# Altium project Adapter_Board.PrjPcb
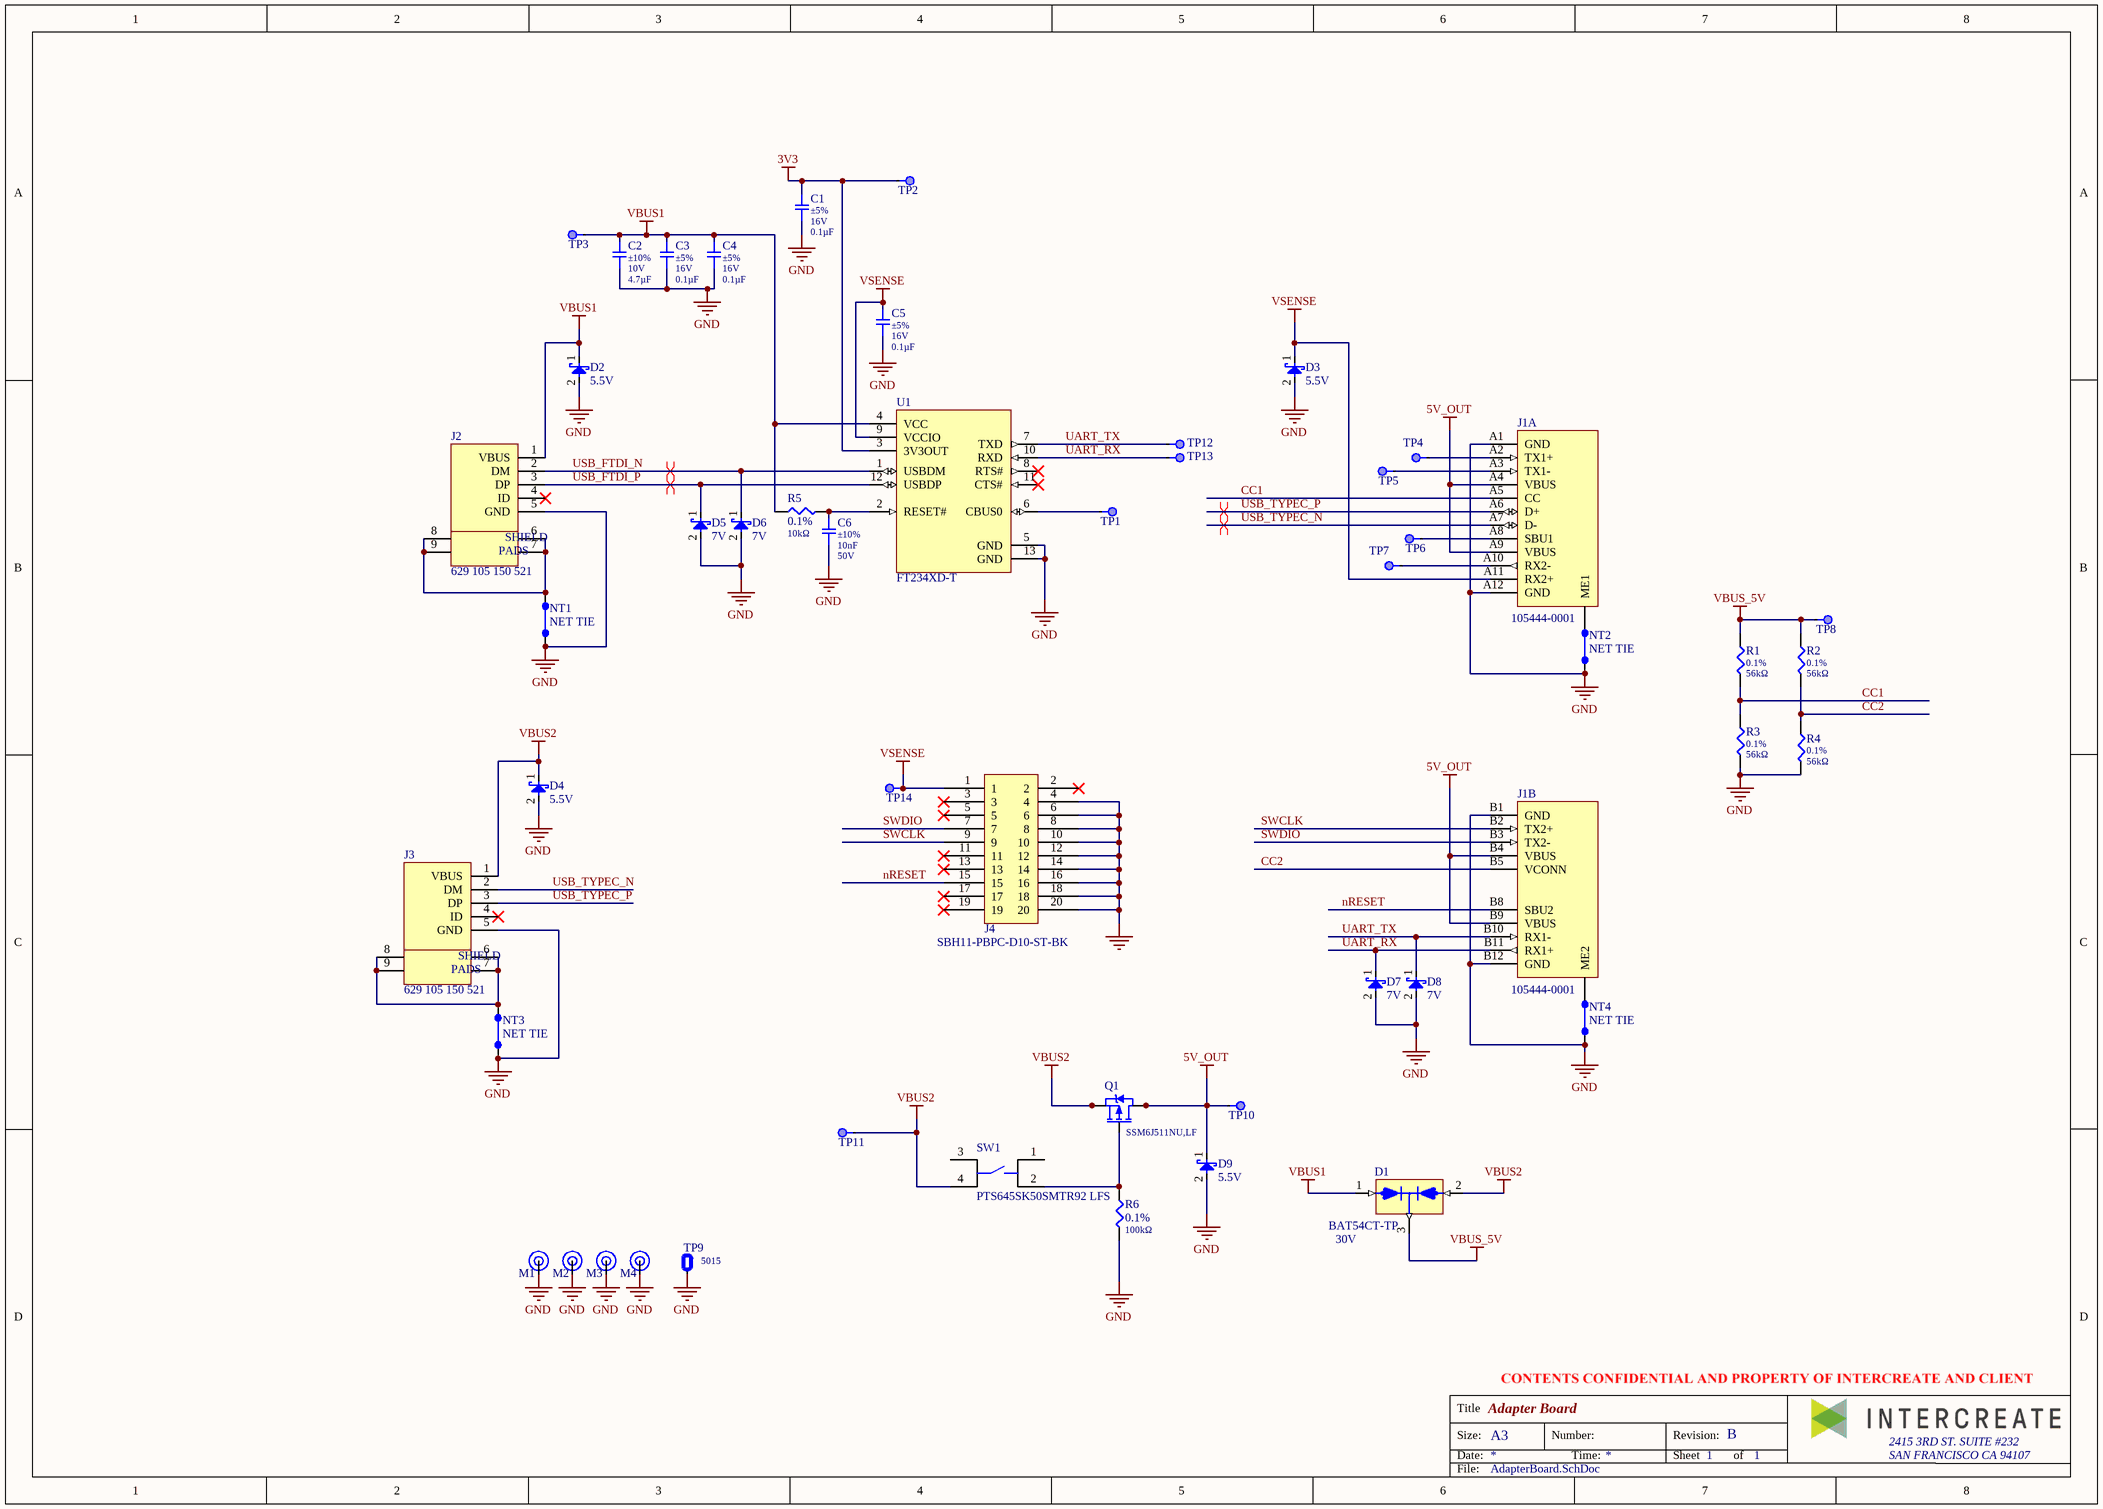
[diagram p0: AdapterBoard.SchDoc]
1 sheet, 50 parts. Net scope: global (net labels, ports and power ports of the same name join across sheets).
Board file: AdapterBoard.PcbDoc

## Sheet AdapterBoard.SchDoc: Adapter Board
size A3; Organization: INTERCREATE; Address1: 2415 3RD ST. SUITE #232; Address2: SAN FRANCISCO CA 94107; Revision: B; SheetNumber: 1; SheetTotal: 1; ProjectName: KAGWERKS COMMAND CENTER

### Parts
C1  value 0.1µF  Tolerance: ±5%  Voltage Rating: 16V  [CAP-0402]  (hidden comment: GRM155R71C104JA88D)
C2  value 4.7µF  Tolerance: ±10%  Voltage Rating: 10V  [CAP-0402]  (hidden comment: CL05A475KP5NRNC)
C3  value 0.1µF  Tolerance: ±5%  Voltage Rating: 16V  [CAP-0402]  (hidden comment: GRM155R71C104JA88D)
C4  value 0.1µF  Tolerance: ±5%  Voltage Rating: 16V  [CAP-0402]  (hidden comment: GRM155R71C104JA88D)
C5  value 0.1µF  Tolerance: ±5%  Voltage Rating: 16V  [CAP-0402]  (hidden comment: GRM155R71C104JA88D)
C6  value 10nF  Tolerance: ±10%  Voltage Rating: 50V  [CAP-0402]  (hidden comment: GCM155R71H103KA55D)
D1  BAT54CT-TP  Voltage Rating (DC): 30V  [IC-SOT-523]
D2  Reverse Standoff Voltage: 5.5V  [DIODE-CST2C]  (hidden comment: DF2S6P2CTC,L3F)
D3  Reverse Standoff Voltage: 5.5V  [DIODE-CST2C]  (hidden comment: DF2S6P2CTC,L3F)
D4  Reverse Standoff Voltage: 5.5V  [DIODE-CST2C]  (hidden comment: DF2S6P2CTC,L3F)
D5  Reverse Standoff Voltage: 7V  [DIODE-0402-LITTLEFUSE]  (hidden comment: RF2943-000)
D6  Reverse Standoff Voltage: 7V  [DIODE-0402-LITTLEFUSE]  (hidden comment: RF2943-000)
D7  Reverse Standoff Voltage: 7V  [DIODE-0402-LITTLEFUSE]  (hidden comment: RF2943-000)
D8  Reverse Standoff Voltage: 7V  [DIODE-0402-LITTLEFUSE]  (hidden comment: RF2943-000)
D9  Reverse Standoff Voltage: 5.5V  [DIODE-CST2C]  (hidden comment: DF2S6P2CTC,L3F)
J1  105444-0001  [CONN-M-USB-C]  (parts A,B of 2)
J2  629 105 150 521  [CONN-R-USB-UB-629105150521]
J3  629 105 150 521  [CONN-R-USB-UB-629105150521]
J4  SBH11-PBPC-D10-ST-BK  [HDR-V-2x10-KEYED]
M1  N/A  [HOLE-M2-NO-SILK]  (value not drawn)  (no BOM)
M2  N/A  [HOLE-M2-NO-SILK]  (value not drawn)  (no BOM)
M3  N/A  [HOLE-M2-NO-SILK]  (value not drawn)  (no BOM)
M4  N/A  [HOLE-M2-NO-SILK]  (value not drawn)  (no BOM)
NT1  NET TIE  [NET_TIE]  (net tie, no BOM)
NT2  NET TIE  [NET_TIE]  (net tie, no BOM)
NT3  NET TIE  [NET_TIE]  (net tie, no BOM)
NT4  NET TIE  [NET_TIE]  (net tie, no BOM)
Q1  SSM6J511NU,LF  [FET-6-DFN-EP]
R1  value 56kΩ  Tolerance: 0.1%  [RES-0402]  (hidden comment: RT0402BRD0756KL)
R2  value 56kΩ  Tolerance: 0.1%  [RES-0402]  (hidden comment: RT0402BRD0756KL)
R3  value 56kΩ  Tolerance: 0.1%  [RES-0402]  (hidden comment: RT0402BRD0756KL)
R4  value 56kΩ  Tolerance: 0.1%  [RES-0402]  (hidden comment: RT0402BRD0756KL)
R5  value 10kΩ  Tolerance: 0.1%  [RES-0402]  (hidden comment: RT0402BRE0710KL)
R6  value 100kΩ  Tolerance: 0.1%  [RES-0402]  (hidden comment: RT0402BRD07100KL)
SW1  PTS645SK50SMTR92 LFS  [BTN-SPST-PTS645SK50SMTR92]
TP1  N/A  [TP-0.75MM]  (value not drawn)  (no BOM)
TP2  N/A  [TP-0.75MM]  (value not drawn)  (no BOM)
TP3  N/A  [TP-0.75MM]  (value not drawn)  (no BOM)
TP4  N/A  [TP-0.75MM]  (value not drawn)  (no BOM)
TP5  N/A  [TP-0.75MM]  (value not drawn)  (no BOM)
TP6  N/A  [TP-0.75MM]  (value not drawn)  (no BOM)
TP7  N/A  [TP-0.75MM]  (value not drawn)  (no BOM)
TP8  N/A  [TP-0.75MM]  (value not drawn)  (no BOM)
TP9  5015  [TP-5015]
TP10  N/A  [TP-0.75MM]  (value not drawn)  (no BOM)
TP11  N/A  [TP-0.75MM]  (value not drawn)  (no BOM)
TP12  N/A  [TP-0.75MM]  (value not drawn)  (no BOM)
TP13  N/A  [TP-0.75MM]  (value not drawn)  (no BOM)
TP14  N/A  [TP-0.75MM]  (value not drawn)  (no BOM)
U1  FT234XD-T  [IC-DFN-12P]

### Nets
3V3: C1.2 TP2.1(TP_1P0MM) U1.3(3V3OUT)
5V_OUT: D9.1(K) J1.A4(VBUS) J1.A9(VBUS) J1.B4(VBUS) J1.B9(VBUS) Q1.1(D) Q1.2(D) Q1.5(D) Q1.6(D) Q1.8(D) TP10.1(TP_1P0MM)
GND: C1.1 C2.1 C3.1 C4.1 C5.1 C6.1 D2.2(A) D3.2(A) D4.2(A) D5.2(A) D6.2(A) D7.2(A) D8.2(A) D9.2(A) J1.A1(GND) J1.A12(GND) J1.B1(GND) J1.B12(GND) J2.5(GND) J3.5(GND) J4.4 J4.6 J4.8 J4.10 J4.12 J4.14 J4.16 J4.18 J4.20 M1.1 M2.1 M3.1 M4.1 NT1.1 NT2.1 NT3.1 NT4.1 R3.2 R4.2 R6.2 TP9.1 U1.5(GND) U1.13(GND)
VBUS1: C2.2 C3.2 C4.2 D1.1 D2.1(K) J2.1(VBUS) R5.1 TP3.1(TP_1P0MM) U1.4(VCC)
VBUS2: D1.2 D4.1(K) J3.1(VBUS) Q1.4(S) Q1.7(S) SW1.4 TP11.1(TP_1P0MM)
VBUS_5V: D1.3 R1.1 R2.1 TP8.1(TP_1P0MM)
VSENSE: C5.2 D3.1(K) J1.A11(RX2+) J4.1 TP14.1(TP_1P0MM) U1.9(VCCIO)
CC1: J1.A5(CC) R1.2 R3.1
CC2: J1.B5(VCONN) R2.2 R4.1
nRESET: J1.B8(SBU2) J4.15
SWCLK: J1.B2(TX2+) J4.9
SWDIO: J1.B3(TX2-) J4.7
UART_RX: D7.1(K) J1.B11(RX1+) TP13.1(TP_1P0MM) U1.10(RXD)
UART_TX: D8.1(K) J1.B10(RX1-) TP12.1(TP_1P0MM) U1.7(TXD)
USB_FTDI_N: D6.1(K) J2.2(DM) U1.1(USBDM)
USB_FTDI_P: D5.1(K) J2.3(DP) U1.12(USBDP)
USB_TYPEC_N: J1.A7(D-) J3.2(DM)
USB_TYPEC_P: J1.A6(D+) J3.3(DP)
NetC6_2: C6.2 R5.2 U1.2(RESET#)
NetJ1_A2: J1.A2(TX1+) TP4.1(TP_1P0MM)
NetJ1_A3: J1.A3(TX1-) TP5.1(TP_1P0MM)
NetJ1_A8: J1.A8(SBU1) TP6.1(TP_1P0MM)
NetJ1_A10: J1.A10(RX2-) TP7.1(TP_1P0MM)
NetJ1_ME1: J1.ME1 NT2.2
NetJ1_ME2: J1.ME2 NT4.2
NetJ2_6: J2.6(PAD) J2.7(PAD) J2.8(PAD) J2.9(PAD) NT1.2
NetJ3_6: J3.6(PAD) J3.7(PAD) J3.8(PAD) J3.9(PAD) NT3.2
NetQ1_3: Q1.3(G) R6.1 SW1.2
NetTP1_1: TP1.1(TP_1P0MM) U1.6(CBUS0)

Not connected (* = marked no-connect by the designer): J2 4(ID)*; J3 4(ID)*; J4 2* 3* 5* 11* 13* 17* 19*; SW1 1 3; U1 8(RTS#)* 11(CTS#)*

### Layout directives
differential pair: USB_FTDI_N, USB_FTDI_P, USB_TYPEC_N, USB_TYPEC_P

### Notes on the sheet
- Title
- Size:
- Date:
- A3
- Number:
- Time:
- Revision:
- Sheet
- of
- File:
- (in symbol CONN-R-USB-uB-WURTH) SHIELD; PADS

### Library data of the parts
C1 C3-C5 = CAP-0.1uF-16V-0402: CAP CER 0.1UF 16V X7R 0402 5%; Manufacturer: Murata; Capacitance: 100nF; Supplier 1: Digi-Key; MPN: GRM155R71C104JA88D; Stock 1: 100000; Pricing 1: 1=0.1, 10=0.051, 100=0.0225, 500=0.0161, 1000=0.01265, 2500=0.0115, 5000=0.01058 (USD); Mount: Surface Mount; Case/Package: 0402; Case Code (Metric): 1005; Case Code (Imperial): 0402; Min Operating Temperature: -55°C; Max Operating Temperature: 125°C; Dielectric: X7R; Voltage Rating (DC): 16V; Packaging: Tape and Reel; Termination: SMD/SMT; Package Quantity: 10000; Length: 1mm; Height: 0.5mm; Width: 0.02inch; Thickness: 0.022inch; Supplier Part Number 1: 490-6327-6-ND; Manufacturer 1: Murata; Manufacturer Part Number 1: GRM155R71C104JA88D; Depth: 0.5mm; Radiation Hardening: No; REACH SVHC: No SVHC; Lead Free: Lead Free; ComponentLink1URL: http://www.mouser.com/ds/2/281/c02e-2905.pdf; ComponentLink1Description: http://www.mouser.com/ds/2/281/c02e-2905.pdf; ComponentLink2URL: http://www.murata.com/products/catalog/pdf/c02e.pdf; ComponentLink2Description: http://www.murata.com/products/catalog/pdf/c02e.pdf; ComponentLink3URL: http://search.murata.co.jp/Ceramy/image/img/A01X/G101/ENG/GRM155R71C104JA88-01.pdf; ComponentLink3Description: http://search.murata.co.jp/Ceramy/image/img/A01X/G101/ENG/GRM155R71C104JA88-01.pdf; Voltage: 16V
C2 = CAP-4.7uF-10V-0402: CAP CER 4.7UF 10V X5R 0402 10%; Manufacturer: Samsung; Supplier 1: Digi-Key; MPN: CL05A475KP5NRNC; Mount: Surface Mount; Case/Package: 0402; Case Code (Metric): 1005; Case Code (Imperial): 0402; Min Operating Temperature: -55°C; Max Operating Temperature: 85°C; Packaging: Cut Tape; Length: 0.039inch; Width: 0.02inch; Thickness: 0.031inch; Supplier Part Number 1: 1276-1480-1-ND; Manufacturer 1: Samsung; Manufacturer Part Number 1: CL05A475KP5NRNC
C6 = CAP-10nF-50V-0402: CAP CER 10nF 50V X7R 0402 10%; Manufacturer: Murata; Supplier 1: Digi-Key; MPN: GCM155R71H103KA55D; Stock 1: 100000; Pricing 1: 1=0.1, 10=0.048, 100=0.0215, 500=0.01538, 1000=0.01208, 2500=0.01098, 5000=0.0101 (USD); Mount: Surface Mount; Case/Package: 0402; Case Code (Imperial): 0402; Case Code (Metric): 1005; Min Operating Temperature: -55°C; Max Operating Temperature: 125°C; Packaging: Tape and Reel; Package Quantity: 1; Dielectric: X7R; Termination: SMD/SMT; Voltage Rating (DC): 50V; Length: 1mm; Height: 0.5mm; Width: 0.02inch; Thickness: 0.022inch; Depth: 0.5mm; Ratings: AEC-Q200; Radiation Hardening: No; REACH SVHC: No SVHC; Lead Free: Lead Free; Supplier Part Number 1: 490-4762-1-ND; Voltage: 50V; Manufacturer 1: Murata; Manufacturer Part Number 1: GCM155R71H103KA55D
D1 = DIODE-SCHOTTKY-30V-BAT54CT: DIODE ARRAY SCHOTTKY 30V SOT523; Manufacturer 1: MCC; Average Rectified Current: 200mA; Reverse Recovery Time: 5ns; Max Reverse Leakage Current: 2uA; Peak Non-Repetitive Surge Current: 600mA; Forward Voltage: 1V; Element Configuration: Common Cathode; Capacitance: 10pF; Supplier 1: Digi-Key; Manufacturer Part Number 1: BAT54CT-TP; RoHS: Yes; Category: Rectifier Diodes; Stock 1: 52882; Pricing 1: 1=0.26000, 10=0.18000, 100=0.08800, 500=0.07340, 1000=0.05100 (USD); Mount: Surface Mount; Case/Package: SOT-523; Number of Pins: 3; Min Operating Temperature: -65°C; Max Operating Temperature: 125°C; Max Repetitive Reverse Voltage (Vrrm): 30V; Forward Current: 200mA; Max Forward Surge Current (Ifsm): 600mA; Package Quantity: 1; Packaging: Tape and Reel; Max Surge Current: 600mA; Recovery Time: 5ns; Current Rating: 200mA; Radiation Hardening: No; REACH SVHC: Unknown; Lead Free: Lead Free; ComponentLink1URL: https://datasheet.ciiva.com/7624/1684805-7624706.pdf?src-supplier=Element14; ComponentLink1Description: https://datasheet.ciiva.com/7624/1684805-7624706.pdf?src-supplier=Element14; ComponentLink2URL: https://datasheet.ciiva.com/15200/getdatasheetpartid-302124-15200436.pdf?src-supplier=Verical; ComponentLink2Description: https://datasheet.ciiva.com/15200/getdatasheetpartid-302124-15200436.pdf?src-supplier=Verical; ComponentLink3URL: https://datasheet.ciiva.com/904/bat54t-at-ct-stsot-523-904754.pdf?src-supplier=Digi-Key; ComponentLink3Description: https://datasheet.ciiva.com/904/bat54t-at-ct-stsot-523-904754.pdf?src-supplier=Digi-Key; ComponentLink4URL: https://datasheet.ciiva.com/904/bat54t-at-ct-stsot-523-904755.pdf?src-supplier=Digi-Key; ComponentLink4Description: https://datasheet.ciiva.com/904/bat54t-at-ct-stsot-523-904755.pdf?src-supplier=Digi-Key; ComponentLink5URL: https://datasheet.ciiva.com/904/bat54t-at-ct-stsot-523-904756.pdf?src-supplier=Digi-Key; ComponentLink5Description: https://datasheet.ciiva.com/904/bat54t-at-ct-stsot-523-904756.pdf?src-supplier=Digi-Key; Supplier Part Number 1: BAT54CT-TPCT-ND; Max Reverse Voltage (DC): 30V
D2-D4 D9 = DIODE-TVS-5.5V-CST2C: TVS DIODE 5.5VWM CST2C; Manufacturer 1: Toshiba; Supplier 1: Digi-Key; Manufacturer Part Number 1: DF2S6P2CTC,L3F; Stock 1: 14024; Pricing 1: 1=0.41000, 10=0.30800, 25=0.27760, 100=0.19180, 250=0.16152, 500=0.13122, 1000=0.10094, 2500=0.09085, 5000=0.08580 (USD); RoHS: No; ComponentLink1URL: https://toshiba.semicon-storage.com/info/docget.jsp?did=58602&prodName=DF2S6P2CTC&src-supplier=Digi-Key; ComponentLink1Description: https://toshiba.semicon-storage.com/info/docget.jsp?did=58602&prodName=DF2S6P2CTC&src-supplier=Digi-Key; Supplier Part Number 1: DF2S6P2CTCL3FCT-ND
D5-D8 = DIODE-TVS-7V-0402: TVS DIODE 7V 9.2V 0402/2DFN; Manufacturer 1: Littelfuse; Polarity: Unidirectional; Breakdown Voltage: 9V; Peak Pulse Current: 2A; Power Line Protection: No; Number of Unidirectional Channels: 1; Supplier 1: Digi-Key; Manufacturer Part Number 1: RF2943-000; RoHS: No; Category: TVS Diodes; Stock 1: 59677; Pricing 1: 1=0.53000, 10=0.45000, 100=0.31200, 500=0.24360, 1000=0.19800, 2000=0.18600, 5000=0.16800 (USD); Mount: Surface Mount; Case/Package: 0402; Number of Pins: 2; Case Code (Imperial): 0402; Case Code (Metric): 1005; Min Operating Temperature: -55°C; Max Operating Temperature: 125°C; Clamping Voltage: 9.2V; Packaging: Tape and Reel; Termination: SMD/SMT; Package Quantity: 10000; Min Breakdown Voltage: 9V; Working Voltage: 9V; Max Surge Current: 2A; Resistor Type: Zener; ComponentLink1URL: http://www.littelfuse.com/~/media/electronics/datasheets/tvs_diode_arrays/littelfuse_tvs_diode_array_sesd_ultra_low_capacitance_discrete_tvs_datasheet.pdf.pdf?src-supplier=Digi-Key; ComponentLink1Description: http://www.littelfuse.com/~/media/electronics/datasheets/tvs_diode_arrays/littelfuse_tvs_diode_array_sesd_ultra_low_capacitance_discrete_tvs_datasheet.pdf.pdf?src-supplier=Digi-Key; ComponentLink2URL: https://www.littelfuse.com/~/media/electronics/datasheets/tvs_diode_arrays/littelfuse_tvs_diode_array_sesd_ultra_low_capacitance_discrete_tvs_datasheet.pdf.pdf?src-supplier=Digi-Key; ComponentLink2Description: https://www.littelfuse.com/~/media/electronics/datasheets/tvs_diode_arrays/littelfuse_tvs_diode_array_sesd_ultra_low_capacitance_discrete_tvs_datasheet.pdf.pdf?src-supplier=Digi-Key; Supplier Part Number 1: SESD0402X1UN-0020-090CT-ND
J1 = CONN-M-USB-C: 105444-0001 Male USB C Connector, Right Angle Surface Mount; Manufacturer 1: Molex; Number of Contacts: 24; Number of Ports: 1; USB Standard: USB 3.1; Current Rating: 5A; Mating Cycles: 10000; Shielding: Shielded; Pitch: 0.5mm; Supplier 1: Digi-Key; Manufacturer Part Number 1: 105444-0001; Stock 1: 6718; Pricing 1: 1=2.66000, 10=2.41100, 25=2.26320, 50=2.16480, 100=2.06640, 250=1.86960, 500=1.72200, 1000=1.47600, 2500=1.37760 (USD); Mount: Straddle Mount; Contact Material: Copper Alloy; Contact Plating: Gold; Number of Terminals: 22; Housing Material: Thermoplastic; Insulation Color: Black; Min Operating Temperature: -30°C; Max Operating Temperature: 85°C; Packaging: Tray; Connector Type: USB; Orientation: Right Angle; Termination: Solder; Gender: Male; Features: Shielded; Length: 9.18mm; REACH SVHC: Unknown; Flammability Rating: UL94 V-0; ComponentLink1URL: http://www.molex.com/pdm_docs/sd/1054440001_sd.pdf?src-supplier=Avnet+Asia; ComponentLink1Description: http://www.molex.com/pdm_docs/sd/1054440001_sd.pdf?src-supplier=Avnet+Asia; ComponentLink2URL: http://www.literature.molex.com/SQLImages/kelmscott/Molex/PDF_Images/987651-4081.PDF?src-supplier=Digi-Key; ComponentLink2Description: http://www.literature.molex.com/SQLImages/kelmscott/Molex/PDF_Images/987651-4081.PDF?src-supplier=Digi-Key; ComponentLink3URL: http://www.molex.com/pdm_docs/sd/1054440001_sd.pdf?src-supplier=Avnet; ComponentLink3Description: http://www.molex.com/pdm_docs/sd/1054440001_sd.pdf?src-supplier=Avnet; ComponentLink4URL: http://www.farnell.com/datasheets/2015275.pdf?src-supplier=Element14; ComponentLink4Description: http://www.farnell.com/datasheets/2015275.pdf?src-supplier=Element14; ComponentLink5URL: http://datasheet.octopart.com/105444-0001-Molex-datasheet-120135262.pdf?src-supplier=Allied+Electronics; ComponentLink5Description: http://datasheet.octopart.com/105444-0001-Molex-datasheet-120135262.pdf?src-supplier=Allied+Electronics; ComponentLink6URL: http://datasheet.octopart.com/1054440001-Molex-datasheet-137325544.pdf?src-supplier=Sager+Electronics; ComponentLink6Description: http://datasheet.octopart.com/1054440001-Molex-datasheet-137325544.pdf?src-supplier=Sager+Electronics; ComponentLink7URL: http://datasheet.octopart.com/105444-0001-Molex-datasheet-62118242.pdf?src-supplier=Farnell; ComponentLink7Description: http://datasheet.octopart.com/105444-0001-Molex-datasheet-62118242.pdf?src-supplier=Farnell; ComponentLink8URL: http://datasheet.octopart.com/105444-0001-Molex-datasheet-77519197.pdf?src-supplier=Newark; ComponentLink8Description: http://datasheet.octopart.com/105444-0001-Molex-datasheet-77519197.pdf?src-supplier=Newark; ComponentLink9URL: http://datasheet.octopart.com/105444-0001-Molex-datasheet-62099280.pdf?src-supplier=Allied+Electronics; ComponentLink9Description: http://datasheet.octopart.com/105444-0001-Molex-datasheet-62099280.pdf?src-supplier=Allied+Electronics; ComponentLink10URL: http://datasheet.octopart.com/105444-0001-Molex-datasheet-62268959.pdf?src-supplier=Newark; ComponentLink10Description: http://datasheet.octopart.com/105444-0001-Molex-datasheet-62268959.pdf?src-supplier=Newark; Supplier Part Number 1: WM12855-ND
J2 J3 = CONN-R-USB-uB-WURTH: CONN RCPT USB MICRO B R/A; Manufacturer 1: Wurth Electronics; Connector Type: USB - micro B; Number of Positions: 5; Manufacturer Part Number 1: 629 105 150 521; ComponentLink1Description: Datasheet; ComponentLink1URL: http://katalog.we-online.de/em/datasheet/629105150521.pdf; Supplier 1: Wurth Electronics; Supplier Part Number 1: 629 105 150 521; Series: WR-COM; Number of Rows: 1; Mounting Type: Surface Mount; Termination: Solder; Contact Finish: Gold; Value: 629 105 150 521
J4 = HDR-V-2x10-M: CONN HEADER VERT 20POS 2.54MM; Manufacturer 1: Sullins; Number of Positions: 20; Connector Type: Male Pin; Pitch: 0.1inch; Supplier 1: Digi-Key; Manufacturer Part Number 1: SBH11-PBPC-D10-ST-BK; Stock 1: 23438; Pricing 1: 1=0.54000, 10=0.51000, 100=0.39120, 500=0.34020, 1000=0.28067, 5000=0.24665, 10000=0.24570 (USD); RoHS: Yes; Mount: Through Hole; Color: Black; Contact Plating: Gold; Package Quantity: 1; Number of Rows: 2; Packaging: Tray; Termination: Solder; Row Spacing: 0.1inch; Lead Free: Lead Free; ComponentLink1URL: https://datasheet.ciiva.com/730/sbh11-pbpc-dxx-st-xx-730919.pdf?src-supplier=Digi-Key; ComponentLink1Description: https://datasheet.ciiva.com/730/sbh11-pbpc-dxx-st-xx-730919.pdf?src-supplier=Digi-Key; Supplier Part Number 1: S9172-ND
M1-M4 = HOLE: MOUNTING HOLES, VARIOUS DIAMETERS; Manufacturer: N/A; MPN: N/A
Q1 = PMOS-12V-14A-UDFN6: MOSFET P-CH 12V 14A UDFN6B; Manufacturer: Toshiba; Rds On Max: 9.1mR; Input Capacitance: 3.35nF; Max Power Dissipation: 1.25W; Supplier 1: Digi-Key; MPN: SSM6J511NU,LF; Stock 1: 10609; Pricing 1: 1=0.63, 10=0.495, 100=0.34, 500=0.2331, 1000=0.17483 (USD); Mount: Surface Mount; Min Operating Temperature: -55°C; Max Operating Temperature: 150°C; Packaging: Cut Tape; Drain to Source Voltage (Vdss): 12V; ComponentLink1URL: https://toshiba.semicon-storage.com/info/docget.jsp?did=30767&prodName=SSM6J511NU; ComponentLink1Description: https://toshiba.semicon-storage.com/info/docget.jsp?did=30767&prodName=SSM6J511NU; Supplier Part Number 1: SSM6J511NULFCT-ND; Continuous Drain Current (ID): 14A; Manufacturer 1: Toshiba; Manufacturer Part Number 1: SSM6J511NU,LF
R1-R4 = RES-56K-0402-0.1%: RES SMD 56K OHM 0.1% 1/16W 0402; Manufacturer 1: Yageo; Manufacturer Part Number 1: RC0402FR-0717K4L; Resistance: 56kR; Power Rating: 62.5mW; Voltage Rating: 50V; Max Power Dissipation: 63mW; Temperature Coefficient: 100ppm/°C; Stock 1: 1340786; Pricing 1: 1=0.10000, 10=0.01600, 100=0.00670, 1000=0.00301, 2500=0.00261, 5000=0.00215 (USD); RoHS: Yes; Case/Package: 0402; Case Code (Metric): 1005; Case Code (Imperial): 0402; Min Operating Temperature: -55°C; Max Operating Temperature: 155°C; Package Quantity: 1; Packaging: Tape and Reel; Composition: Thick Film; Number of Terminations: 2; Termination: SMD/SMT; Military Standard: Not; Voltage Rating (DC): 50V; Working Voltage: 50V; Features: Moisture Resistant; Length: 1mm; Height: 0.016inch; Width: 0.02inch; Depth: 0.5mm; Lead Free: Lead Free; ComponentLink1URL: https://datasheet.ciiva.com/2453/pyu-r-int-thick-7-2453648.pdf?src-supplier=Digi-Key; ComponentLink1Description: https://datasheet.ciiva.com/2453/pyu-r-int-thick-7-2453648.pdf?src-supplier=Digi-Key; ComponentLink2URL: https://datasheet.ciiva.com/26829/getdatasheetpartid-329233-26829932.pdf?src-supplier=Verical; ComponentLink2Description: https://datasheet.ciiva.com/26829/getdatasheetpartid-329233-26829932.pdf?src-supplier=Verical; ComponentLink3URL: https://datasheet.ciiva.com/2453/pyu-r-int-thick-7-2453646.pdf?src-supplier=Digi-Key; ComponentLink3Description: https://datasheet.ciiva.com/2453/pyu-r-int-thick-7-2453646.pdf?src-supplier=Digi-Key; ComponentLink4URL: https://datasheet.ciiva.com/2453/pyu-r-int-thick-7-2453647.pdf?src-supplier=Digi-Key; ComponentLink4Description: https://datasheet.ciiva.com/2453/pyu-r-int-thick-7-2453647.pdf?src-supplier=Digi-Key; Supplier 1: Digi-Key; Supplier Part Number 1: YAG1454CT-ND
R5 = RES-10K-0402-0.1%: RES SMD 10K OHM 0.1% 1/16W 0402; Manufacturer 1: Yageo; Max Power Dissipation: 63mW; Temperature Coefficient: 50ppm/°C; Voltage Rating (DC): 50V; Resistance: 10kR; Power Rating: 62.5mW; Supplier 1: Digi-Key; Manufacturer Part Number 1: RT0402BRE0710KL; RoHS: Yes; Category: Chip SMD Resistors; Stock 1: 18470; Pricing 1: 1=0.39000, 10=0.27800, 100=0.11130, 1000=0.05484, 2500=0.05081, 5000=0.04597 (USD); Case/Package: 0402; Case Code (Metric): 1005; Case Code (Imperial): 0402; Min Operating Temperature: -55°C; Max Operating Temperature: 125°C; Number of Terminations: 2; Termination: SMD/SMT; Military Standard: Not; Features: Moisture Resistant; Packaging: Tape and Reel; Package Quantity: 10000; Voltage Rating: 50V; Working Voltage: 50V; Composition: Thin Film; Length: 0.039inch; Height: 0.014inch; Depth: 0.5mm; Width: 0.02inch; Lead Free: Lead Free; ComponentLink1URL: https://datasheet.ciiva.com/2582/pyu-rt-1-to-0-05-rohs-l-5-2582552.pdf?src-supplier=Digi-Key; ComponentLink1Description: https://datasheet.ciiva.com/2582/pyu-rt-1-to-0-05-rohs-l-5-2582552.pdf?src-supplier=Digi-Key; ComponentLink2URL: https://datasheet.ciiva.com/12722/pyu-rt-1-to-0-05-rohs-l-4-12722271.pdf?src-supplier=Mouser; ComponentLink2Description: https://datasheet.ciiva.com/12722/pyu-rt-1-to-0-05-rohs-l-4-12722271.pdf?src-supplier=Mouser; Supplier Part Number 1: YAG2305CT-ND
R6 = RES-100K-0402-0.1%: RES SMD 100KOHM 0.1% 1/16W 0402; Manufacturer 1: Yageo; Resistance: 100kR; Power Rating: 62.5mW; Voltage Rating: 50V; Max Power Dissipation: 63mW; Temperature Coefficient: 25ppm/°C; Supplier 1: Digi-Key; Manufacturer Part Number 1: RT0402BRD07100KL; Stock 1: 220537; Pricing 1: 1=0.38000, 10=0.29000, 100=0.12180, 1000=0.06720, 2500=0.06300, 5000=0.05800 (USD); RoHS: Yes; Case/Package: 0402; Case Code (Metric): 1005; Case Code (Imperial): 0402; Min Operating Temperature: -55°C; Max Operating Temperature: 125°C; Packaging: Tape and Reel; Composition: Thin Film; Number of Terminations: 2; Termination: SMD/SMT; Military Standard: Not; Voltage Rating (DC): 50V; Features: Moisture Resistant; Length: 0.039inch; Height: 0.014inch; Width: 0.02inch; Depth: 0.5mm; Lead Free: Lead Free; ComponentLink1URL: https://datasheet.ciiva.com/12724/pyu-rt-1-to-0-05-rohs-l-4-12724954.pdf?src-supplier=Mouser; ComponentLink1Description: https://datasheet.ciiva.com/12724/pyu-rt-1-to-0-05-rohs-l-4-12724954.pdf?src-supplier=Mouser; Supplier Part Number 1: YAG1343CT-ND
SW1 = BTN-SPST-PTS645SK50SMTR92: C & K COMPONENTS - PTS645SK50SMTR92LFS - SWITCH, SPST, 0.05A, 12VDC, SMD, 5MM; Manufacturer 1: ITT C&K; Mechanical Life: 100000Cycles; Operating Force: 260gf; Max Current Rating: 50mA; Max Voltage Rating (DC): 12V; Illumination Type: Non-Illuminated,Illuminated; Switch Function: Off-Mom; Actuator Type: Standard; Actuator Length: 1.55mm; Actuator Material: Nylon,Polyamide,PA66; Contact Resistance: 100mR; Supplier 1: Digi-Key; Manufacturer Part Number 1: PTS645SK50SMTR92LFS; RoHS: Yes; Category: Tactile Switches; Stock 1: 52601; Pricing 1: 1=0.15000, 10=0.14900, 25=0.14120, 100=0.12840, 250=0.12068, 500=0.11042 (USD); Mount: Surface Mount; Case/Package: SMD/SMT; Contact Material: Bronze; Min Operating Temperature: -20°C; Max Operating Temperature: 60°C; Throw Configuration: SPST; Termination: Gull Wing; Voltage Rating (DC): 12V; Packaging: Tape and Reel; Package Quantity: 1; Current Rating: 50mA; Orientation: Straight; Series: PTS645; Length: 6mm; Depth: 9mm; REACH SVHC: No SVHC; RoHS Compliant: Yes; ComponentLink1URL: https://datasheet.ciiva.com/29903/getdatasheetpartid-741134-29903854.pdf?src-supplier=Verical; ComponentLink1Description: https://datasheet.ciiva.com/29903/getdatasheetpartid-741134-29903854.pdf?src-supplier=Verical; ComponentLink2URL: https://datasheet.ciiva.com/14920/pts645-14920581.pdf?src-supplier=Digi-Key; ComponentLink2Description: https://datasheet.ciiva.com/14920/pts645-14920581.pdf?src-supplier=Digi-Key; Supplier Part Number 1: CKN9087CT-ND; Contact Plating: Silver; Color: Red; Lead Free: Lead Free; ComponentLink3URL: https://datasheet.ciiva.com/22637/1707731-22637358.pdf?src-supplier=Element14; ComponentLink3Description: https://datasheet.ciiva.com/22637/1707731-22637358.pdf?src-supplier=Element14
TP1-TP8 TP10-TP14 = TP: TESTPOINT - VARIOUS SHAPES; Manufacturer: N/A; MPN: N/A
TP9 = TP-5015: PC TEST POINT MINIATURE; Manufacturer 1: Keystone Electronics; Number of Ports: 1; Supplier 1: Digi-Key; Manufacturer Part Number 1: 5015; Stock 1: 1261126; Pricing 1: 1=0.35000, 10=0.34400, 25=0.32760, 100=0.24740, 250=0.23676, 500=0.21908 (USD); RoHS: Yes; Mount: Surface Mount; Contact Plating: Silver,Tin,Lead; Contact Material: Bronze; Material: Bronze,Silver; Color: White; Package Quantity: 1; Packaging: Tape and Reel; Termination: Solder; Orientation: Straight; Length: 2.66mm; Height: 0.06inch; Depth: 1.01mm; Thickness: 0.01inch; Lead Free: Lead Free; REACH SVHC: No SVHC; ComponentLink1URL: https://datasheet.ciiva.com/1123/5015-1123862.pdf?src-supplier=Newark; ComponentLink1Description: https://datasheet.ciiva.com/1123/5015-1123862.pdf?src-supplier=Newark; ComponentLink2URL: https://datasheet.ciiva.com/2917/5015-2917616.pdf?src-supplier=Digi-Key; ComponentLink2Description: https://datasheet.ciiva.com/2917/5015-2917616.pdf?src-supplier=Digi-Key; ComponentLink3URL: https://datasheet.ciiva.com/2917/5015-2917617.pdf?src-supplier=Digi-Key; ComponentLink3Description: https://datasheet.ciiva.com/2917/5015-2917617.pdf?src-supplier=Digi-Key; ComponentLink4URL: https://datasheet.ciiva.com/16883/70182998-16883734.pdf?src-supplier=Allied+Electronics; ComponentLink4Description: https://datasheet.ciiva.com/16883/70182998-16883734.pdf?src-supplier=Allied+Electronics; Supplier Part Number 1: 36-5015CT-ND
U1 = IC-USB-FTDI-FT234XD: USB Full Speed to Basic UART IC with USB Charger Detection; Manufacturer 1: FTDI; Number of Channels: 1; Operating Supply Voltage: 5.25V; Max Supply Voltage: 5.5V; Min Supply Voltage: 2.97V; Interface: USB,UART; Data Rate: 480Mbps; Operating Supply Current: 8mA; Supplier 1: Digi-Key; Manufacturer Part Number 1: FT234XD-T; RoHS: Yes; Category: Interface ICs; Stock 1: 2438; Pricing 1: 1=2.04000, 25=1.97000, 100=1.90000, 250=1.71000, 500=1.54002, 1000=1.46001, 2500=1.43750 (USD); Mount: Surface Mount; Case/Package: DFN; Number of Pins: 12; Min Operating Temperature: -40°C; Max Operating Temperature: 85°C; Packaging: Tray; Package Quantity: 490; ComponentLink1URL: https://datasheet.ciiva.com/12096/ds-ft234xd-220088-12096048.pdf?src-supplier=Mouser; ComponentLink1Description: https://datasheet.ciiva.com/12096/ds-ft234xd-220088-12096048.pdf?src-supplier=Mouser; ComponentLink2URL: https://datasheet.ciiva.com/49014/70403923-49014570.pdf?src-supplier=Allied+Electronics; ComponentLink2Description: https://datasheet.ciiva.com/49014/70403923-49014570.pdf?src-supplier=Allied+Electronics; Supplier Part Number 1: 768-1345-ND

## Assembly variants
Mfg: not fitted R3 R4